# Altium schematic sheet Top.SchDoc
size A4; SheetNumber: 1; SheetTotal: 10
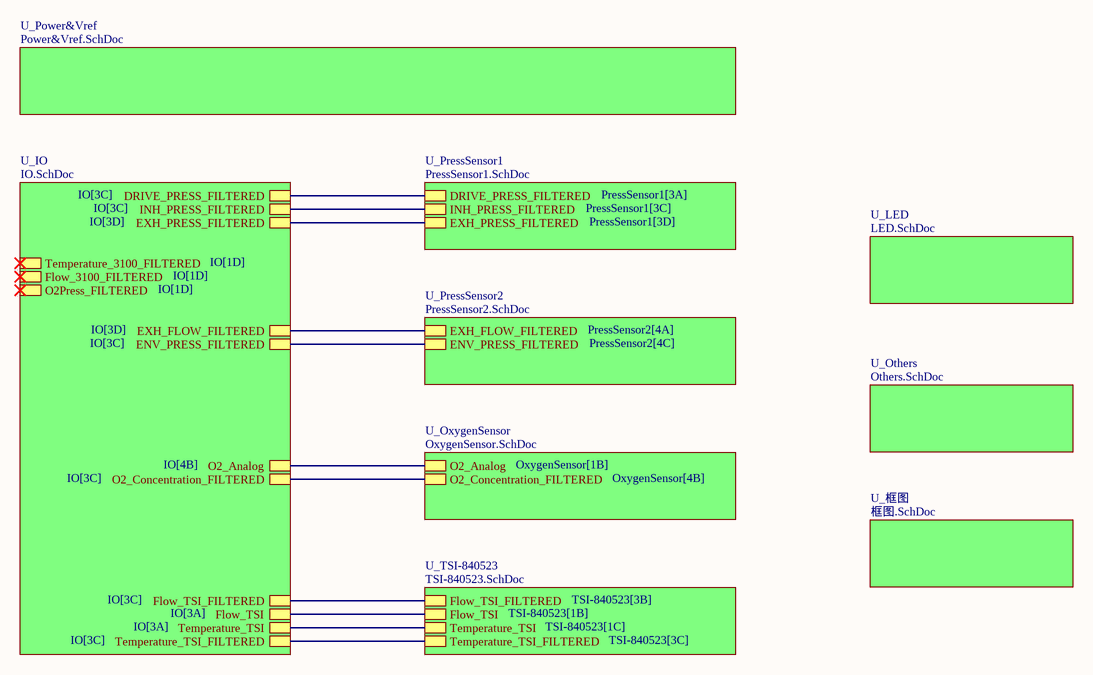
[diagram p0: Top.SchDoc]

## Sub-sheets
U_IO = IO.SchDoc: O2_Concentration_FILTERED, Flow_TSI_FILTERED, Flow_TSI, Temperature_TSI, Temperature_TSI_FILTERED, DRIVE_PRESS_FILTERED, INH_PRESS_FILTERED, EXH_PRESS_FILTERED, EXH_FLOW_FILTERED, ENV_PRESS_FILTERED, O2_Analog, Temperature_3100_FILTERED, Flow_3100_FILTERED, O2Press_FILTERED
U_LED = LED.SchDoc: no entries
U_Others = Others.SchDoc: no entries
U_OxygenSensor = OxygenSensor.SchDoc: O2_Analog, O2_Concentration_FILTERED
U_Power&Vref = Power&Vref.SchDoc: no entries
U_PressSensor1 = PressSensor1.SchDoc: DRIVE_PRESS_FILTERED, INH_PRESS_FILTERED, EXH_PRESS_FILTERED
U_PressSensor2 = PressSensor2.SchDoc: EXH_FLOW_FILTERED, ENV_PRESS_FILTERED
U_TSI-840523 = TSI-840523.SchDoc: Flow_TSI_FILTERED, Flow_TSI, Temperature_TSI, Temperature_TSI_FILTERED
U_框图 = 框图.SchDoc: no entries

## Nets
(unnamed): sheet U_OxygenSensor/O2_Analog, sheet U_IO/O2_Analog
(unnamed): sheet U_OxygenSensor/O2_Concentration_FILTERED, sheet U_IO/O2_Concentration_FILTERED
(unnamed): sheet U_PressSensor1/DRIVE_PRESS_FILTERED, sheet U_IO/DRIVE_PRESS_FILTERED
(unnamed): sheet U_PressSensor1/INH_PRESS_FILTERED, sheet U_IO/INH_PRESS_FILTERED
(unnamed): sheet U_PressSensor1/EXH_PRESS_FILTERED, sheet U_IO/EXH_PRESS_FILTERED
(unnamed): sheet U_PressSensor2/EXH_FLOW_FILTERED, sheet U_IO/EXH_FLOW_FILTERED
(unnamed): sheet U_PressSensor2/ENV_PRESS_FILTERED, sheet U_IO/ENV_PRESS_FILTERED
(unnamed): sheet U_TSI-840523/Flow_TSI_FILTERED, sheet U_IO/Flow_TSI_FILTERED
(unnamed): sheet U_TSI-840523/Flow_TSI, sheet U_IO/Flow_TSI
(unnamed): sheet U_TSI-840523/Temperature_TSI, sheet U_IO/Temperature_TSI
(unnamed): sheet U_TSI-840523/Temperature_TSI_FILTERED, sheet U_IO/Temperature_TSI_FILTERED